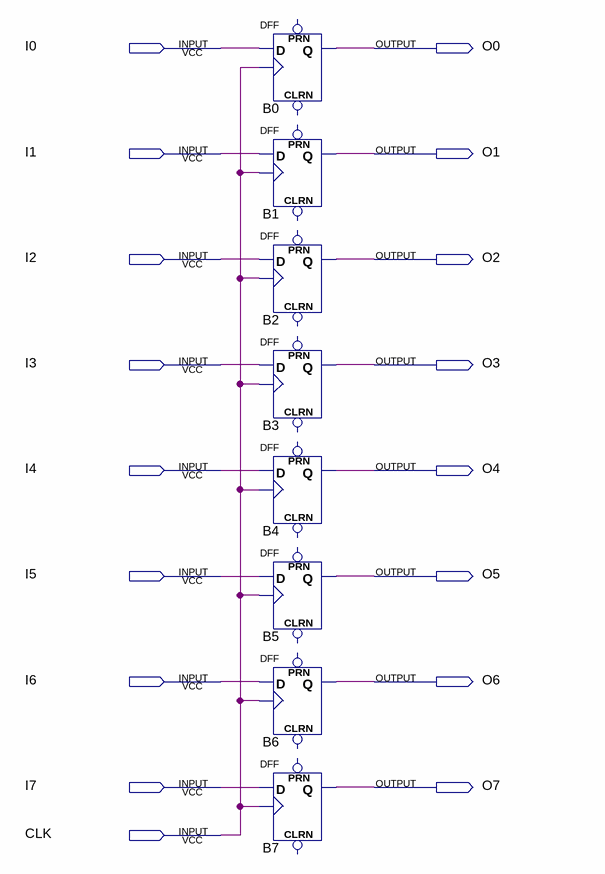
[diagram p0: schematic sheet]
// Quartus schematic Scheme.bdf as structural Verilog: 8 symbols, 17 pins
module Scheme (
  input  I0,
  input  I1,
  input  I2,
  input  I3,
  input  I4,
  input  I5,
  input  I6,
  input  I7,
  input  CLK,
  output O0,
  output O1,
  output O2,
  output O3,
  output O4,
  output O5,
  output O6,
  output O7
);

  DFF B0 (.CLK(CLK), .D(I0), .Q(O0));  // open: CLRN, PRN
  DFF B1 (.CLK(CLK), .D(I1), .Q(O1));  // open: CLRN, PRN
  DFF B2 (.CLK(CLK), .D(I2), .Q(O2));  // open: CLRN, PRN
  DFF B3 (.CLK(CLK), .D(I3), .Q(O3));  // open: CLRN, PRN
  DFF B4 (.CLK(CLK), .D(I4), .Q(O4));  // open: CLRN, PRN
  DFF B5 (.CLK(CLK), .D(I5), .Q(O5));  // open: CLRN, PRN
  DFF B6 (.CLK(CLK), .D(I6), .Q(O6));  // open: CLRN, PRN
  DFF B7 (.CLK(CLK), .D(I7), .Q(O7));  // open: CLRN, PRN
endmodule
